# Altium schematic sheet beaglebone-interface-hw.SchDoc
size A3; SheetNumber: 1; SheetTotal: 10
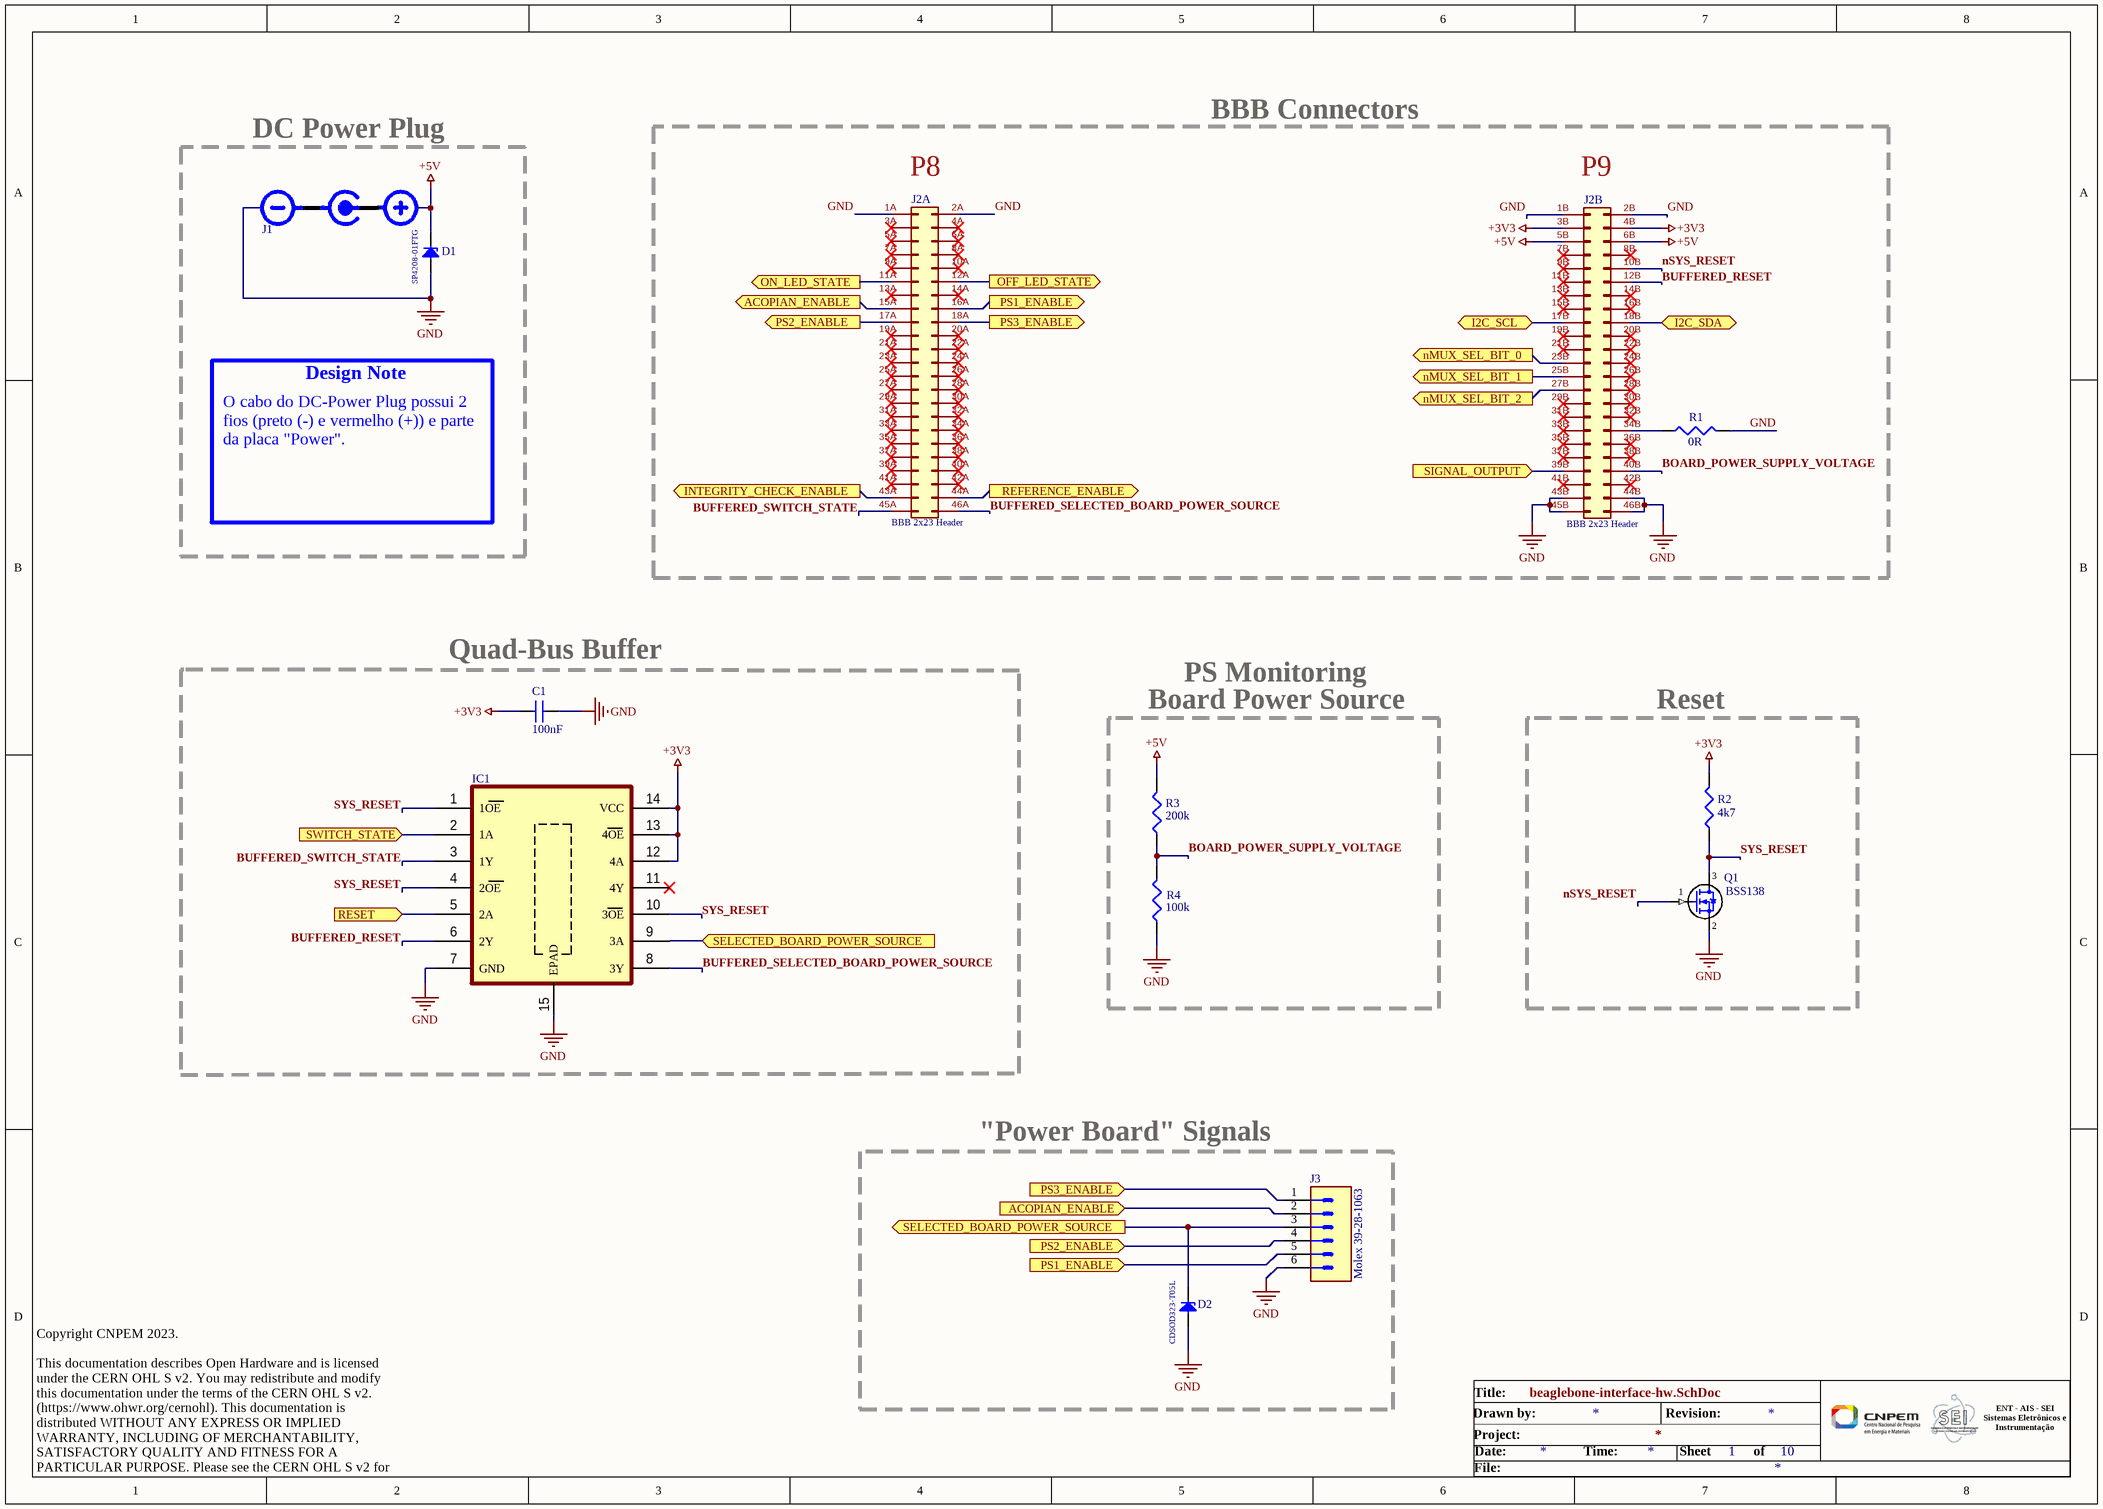
[diagram p0: beaglebone-interface-hw.SchDoc]

## Parts
C1  100nF  [C0805]
D1  SP4208-01FTG  [SOD-323]
D2  CDSOD323-T05L  [SOD-323]
IC1  SN74LV125ARGYR  [VQFN-14]  (value not drawn)
J1  DC Power Plug  (value not drawn)  (graphical)
J2  BBB 2x23 Header  [BBB 2x23 Header]  (parts A,B of 2)
J3  Molex 39-28-1063  [MOLEX_39-28-1063]
Q1  BSS138  [SOT_23_3]
R1  0R  [R1210]
R2  4k7  [Resistor 0805]
R3  200k  [Resistor 0805]
R4  100k  [Resistor 0805]

## Blocks framed on the sheet
DC Power Plug: D1 J1
Quad-Bus Buffer: C1 IC1
Board Power Source: R3 R4
Reset: Q1 R2
"Power Board" Signals: D2 J3

## Ports
ACOPIAN_ENABLE (in, see beaglebone-interface-hw[3A]), ACOPIAN_ENABLE (out, see beaglebone-interface-hw[4D]), I2C_SCL (bidir, see temp-sensor-interface-hw[5B]), I2C_SDA (bidir, see temp-sensor-interface-hw[5B]), INTEGRITY_CHECK_ENABLE (out, see calibration-hw[6B]), nMUX_SEL_BIT_0 (out, see isolated-analog-interface-hw[5B]), nMUX_SEL_BIT_1 (out, see isolated-analog-interface-hw[5C]), nMUX_SEL_BIT_2 (out, see isolated-analog-interface-hw[5C]), OFF_LED_STATE (out, see frontpanel-hw[5D]), ON_LED_STATE (out, see frontpanel-hw[5C]), PS1_ENABLE (in, see beaglebone-interface-hw[4A]), PS1_ENABLE (out, see beaglebone-interface-hw[4D]), PS2_ENABLE (in, see beaglebone-interface-hw[3A]), PS2_ENABLE (out, see beaglebone-interface-hw[4D]), PS3_ENABLE (in, see beaglebone-interface-hw[4A]), PS3_ENABLE (out, see beaglebone-interface-hw[4D]), REFERENCE_ENABLE (out, see calibration-hw[6C]), RESET (in, see frontpanel-hw[5B]), SELECTED_BOARD_POWER_SOURCE (in, see beaglebone-interface-hw[4D]), SELECTED_BOARD_POWER_SOURCE (out, see beaglebone-interface-hw[3C]), SIGNAL_OUTPUT (in, see isolated-analog-interface-hw[10C]), SWITCH_STATE (in, see frontpanel-hw[5A])

## Nets
+3V3: C1.2 IC1.12(4A) IC1.13(4OE) IC1.14(VCC) J2.3B(Pin_3) J2.4B(Pin_4) R2.2
+5V: D1.1 J1.2(+VCC) J2.5B(Pin_5) J2.6B(Pin_6) R3.2
GND: C1.1 D1.2 D2.2 IC1.7(GND) IC1.15(EPAD) J1.1(GND) J2.1A(Pin_1) J2.1B(Pin_1) J2.2A(Pin_2) J2.2B(Pin_2) J2.43B(Pin_43) J2.44B(Pin_44) J2.45B(Pin_45) J2.46B(Pin_46) J3.6 Q1.2(S) R1.2 R4.1
ACOPIAN_ENABLE: J2.15A(Pin_15) J3.2 ; port ACOPIAN_ENABLE
BOARD_POWER_SUPPLY_VOLTAGE: J2.40B(Pin_40) R3.1 R4.2
BUFFERED_RESET: IC1.6(2Y) J2.12B(Pin_12)
BUFFERED_SELECTED_BOARD_POWER_SOURCE: IC1.8(3Y) J2.46A(Pin_46)
BUFFERED_SWITCH_STATE: IC1.3(1Y) J2.45A(Pin_45)
I2C_SCL: J2.17B(Pin_17) ; port I2C_SCL
I2C_SDA: J2.18B(Pin_18) ; port I2C_SDA
INTEGRITY_CHECK_ENABLE: J2.43A(Pin_43) ; port INTEGRITY_CHECK_ENABLE
nMUX_SEL_BIT_0: J2.23B(Pin_23) ; port nMUX_SEL_BIT_0
nMUX_SEL_BIT_1: J2.25B(Pin_25) ; port nMUX_SEL_BIT_1
nMUX_SEL_BIT_2: J2.27B(Pin_27) ; port nMUX_SEL_BIT_2
nSYS_RESET: J2.10B(Pin_10) Q1.1(G)
OFF_LED_STATE: J2.12A(Pin_12) ; port OFF_LED_STATE
ON_LED_STATE: J2.11A(Pin_11) ; port ON_LED_STATE
PS1_ENABLE: J2.16A(Pin_16) J3.5 ; port PS1_ENABLE
PS2_ENABLE: J2.17A(Pin_17) J3.4 ; port PS2_ENABLE
PS3_ENABLE: J2.18A(Pin_18) J3.1 ; port PS3_ENABLE
REFERENCE_ENABLE: J2.44A(Pin_44) ; port REFERENCE_ENABLE
RESET: IC1.5(2A) ; port RESET
SELECTED_BOARD_POWER_SOURCE: D2.1 IC1.9(3A) J3.3 ; port SELECTED_BOARD_POWER_SOURCE
SIGNAL_OUTPUT: J2.39B(Pin_39) ; port SIGNAL_OUTPUT
SWITCH_STATE: IC1.2(1A) ; port SWITCH_STATE
SYS_RESET: IC1.1(1OE) IC1.4(2OE) IC1.10(3OE) Q1.3(D) R2.1
NetJ2_34B: J2.34B(Pin_34) R1.1

Not connected (* = marked no-connect by the designer): IC1 11(4Y)*; J2 3A(Pin_3)* 4A(Pin_4)* 5A(Pin_5)* 6A(Pin_6)* 7A(Pin_7)* 7B(Pin_7)* 8A(Pin_8)* 8B(Pin_8)* 9A(Pin_9)* 9B(Pin_9)* 10A(Pin_10)* 11B(Pin_11)* 13A(Pin_13)* 13B(Pin_13)* 14A(Pin_14)* 14B(Pin_14)* 15B(Pin_15)* 16B(Pin_16)* 19A(Pin_19)* 19B(Pin_19)* 20A(Pin_20)* 20B(Pin_20)* 21A(Pin_21)* 21B(Pin_21)* 22A(Pin_22)* 22B(Pin_22)* 23A(Pin_23)* 24A(Pin_24)* 24B(Pin_24)* 25A(Pin_25)* 26A(Pin_26)* 26B(Pin_26)* 27A(Pin_27)* 28A(Pin_28)* 28B(Pin_28)* 29A(Pin_29)* 29B(Pin_29)* 30A(Pin_30)* 30B(Pin_30)* 31A(Pin_31)* 31B(Pin_31)* 32A(Pin_32)* 32B(Pin_32)* 33A(Pin_33)* 33B(Pin_33)* 34A(Pin_34)* 35A(Pin_35)* 35B(Pin_35)* 36A(Pin_36)* 36B(Pin_36)* 37A(Pin_37)* 37B(Pin_37)* 38A(Pin_38)* 38B(Pin_38)* 39A(Pin_39)* 40A(Pin_40)* 41A(Pin_41)* 41B(Pin_41)* 42A(Pin_42)* 42B(Pin_42)*

## Notes on the sheet
- (near J2) P8
- BBB Connectors
- (near J2) P9
- Design Note
- O cabo do DC-Power Plug possui 2 fios (preto (-) e vermelho (+)) e parte da placa "Power".
- PS Monitoring
- Title:
- Date:
- Project:
- Drawn by:
- Time:
- Revision:
- Sheet
- of
- ENT - AIS - SEI
  Sistemas Eletrônicos e
  Instrumentação
- Copyright CNPEM 2023.
  This documentation describes Open Hardware and is licensed under the CERN OHL S v2. You may redistribute and modify this documentation under the terms of the CERN OHL S v2. (https://www.ohwr.org/cernohl). This documentation is distributed WITHOUT ANY EXPRESS OR IMPLIED WARRANTY, INCLUDING OF MERCHANTABILITY, SATISFACTORY QUALITY AND FITNESS FOR A PARTICULAR PURPOSE. Please see the CERN OHL S v2 for applicable conditions.
- File:

## Library data of the parts
C1 = Capacitor 100nF
D1 = SP4208-01FTG: Unidirectional TVS Diode; Supplier 1: Newark; Supplier Part Number 1: 54AH3799
D2 = CDSOD323-T05L: Unidirectional TVS Diode; Supplier 1: Avnet; Supplier Part Number 1: CDSOD323-T05L
IC1 = SN74LV125ARGYR: Quadruple Bus Buffer Gates With 3-State Outputs
J3 = Connector 6 Male
Q1 = BSS138: MOSFET N-Channel; Supplier 1: Digi-Key; Supplier Part Number 1: BSS138DKR-ND
R1 = Resistor 0R: Size 1210
R2 = Resistor 4k7: Size 0805
R3 = Resistor 200k: Size 0805
R4 = Resistor 100k